# Altium schematic sheet TC PCB.SchDoc
size A4
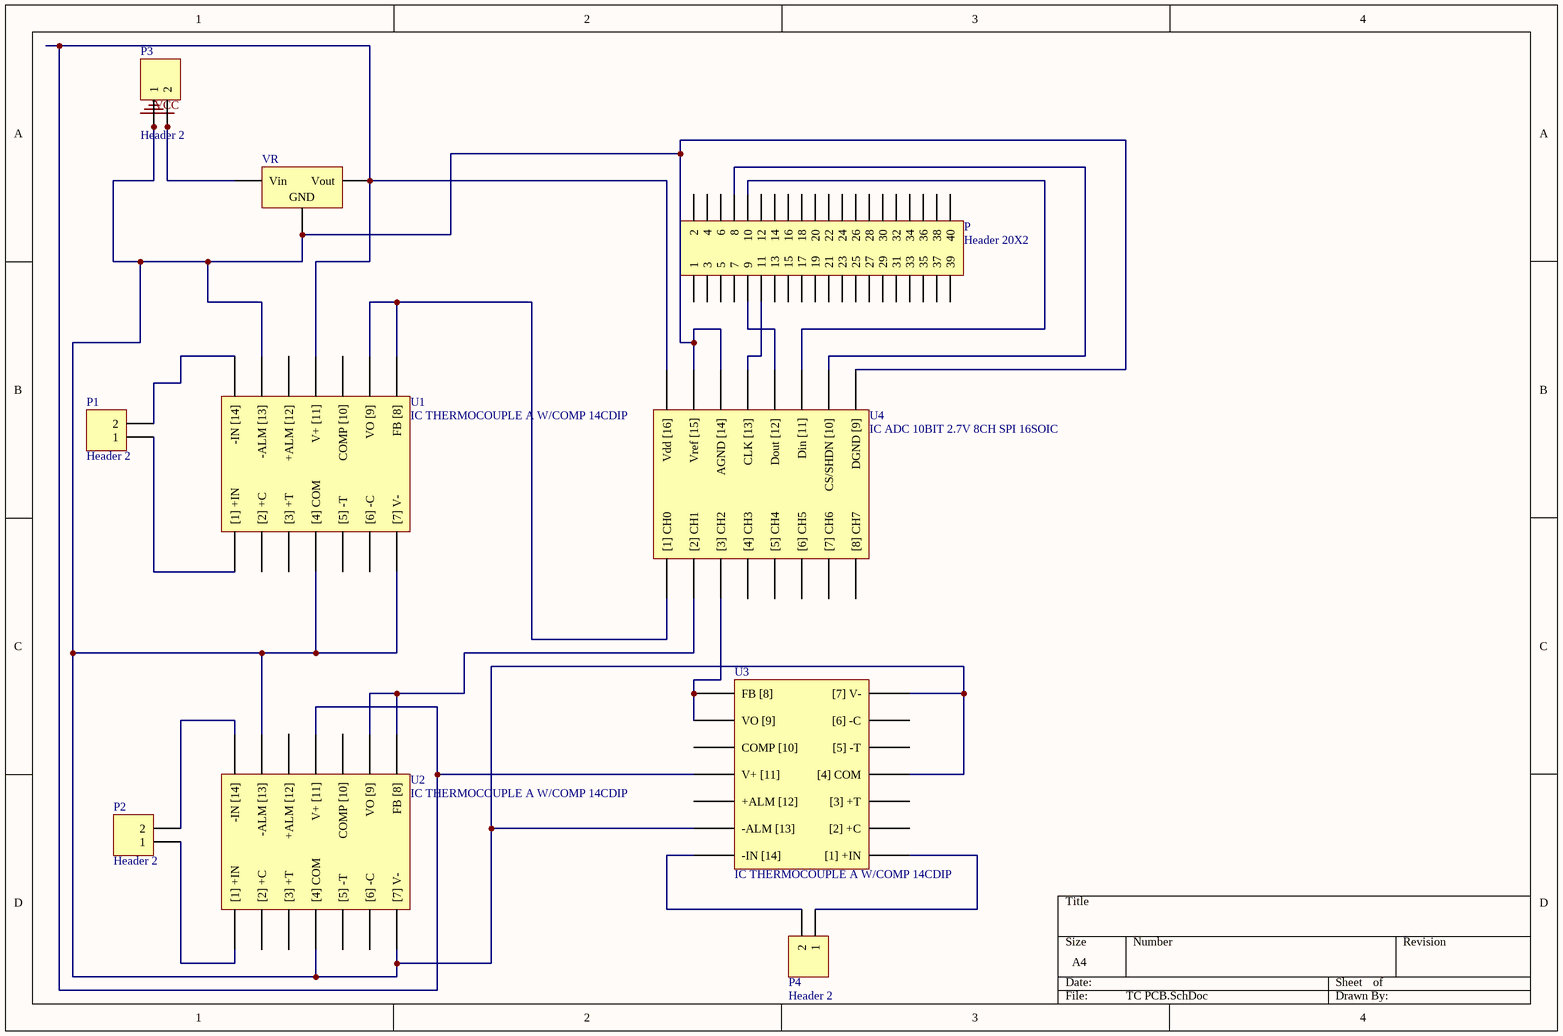
[diagram p0: TC PCB.SchDoc]

## Parts
P  Header 20X2  [HDR2X20]
P1  Header 2  [HDR1X2]
P2  Header 2  [HDR1X2]
P3  Header 2  [HDR1X2]
P4  Header 2  [HDR1X2]
U1  IC THERMOCOUPLE A W/COMP 14CDIP  [IC THERMOCOUPLE A W/COMP 14CDIP]
U2  IC THERMOCOUPLE A W/COMP 14CDIP  [IC THERMOCOUPLE A W/COMP 14CDIP]
U3  IC THERMOCOUPLE A W/COMP 14CDIP  [IC THERMOCOUPLE A W/COMP 14CDIP]
U4  IC ADC 10BIT 2.7V 8CH SPI 16SOIC  [IC ADC 10BIT 2.7V 8CH SPI 16SOIC]
VR  Volt Reg  [D2PAK_N]  (value not drawn)

## Nets
GND: P3.1 U1.4([4]_COM) U1.7([7]_V-) U1.13(-ALM_[13]) U2.4([4]_COM) U2.7([7]_V-) U2.13(-ALM_[13]) U3.4([4]_COM) U3.7([7]_V-) U3.13(-ALM_[13]) U4.9(DGND_[9]) U4.14(AGND_[14]) U4.15(Vref_[15]) VR.2(GND)
VCC: P3.2 VR.1(Vin)
NetP1_1: P1.1 U1.1([1]_+IN)
NetP1_2: P1.2 U1.14(-IN_[14])
NetP2_1: P2.1 U2.1([1]_+IN)
NetP2_2: P2.2 U2.14(-IN_[14])
NetP4_1: P4.1 U3.1([1]_+IN)
NetP4_2: P4.2 U3.14(-IN_[14])
NetP_8: P.8 U4.10(CS/SHDN_[10])
NetP_9: P.9 U4.12(Dout_[12])
NetP_10: P.10 U4.11(Din_[11])
NetP_11: P.11 U4.13(CLK_[13])
NetU1_8: U1.8(FB_[8]) U1.9(VO_[9]) U4.1([1]_CH0)
NetU1_11: U1.11(V+_[11]) U2.11(V+_[11]) U3.11(V+_[11]) U4.16(Vdd_[16]) VR.3(Vout)
NetU2_8: U2.8(FB_[8]) U2.9(VO_[9]) U4.2([2]_CH1)
NetU3_8: U3.8(FB_[8]) U3.9(VO_[9]) U4.3([3]_CH2)

Not connected (* = marked no-connect by the designer): P 1 2 3 4 5 6 7 12 13 14 15 16 17 18 19 20 21 22 23 24 25 26 27 28 29 30 31 32 33 34 35 36 37 38 39 40; U1 2([2]_+C) 3([3]_+T) 5([5]_-T) 6([6]_-C) 10(COMP_[10]) 12(+ALM_[12]); U2 2([2]_+C) 3([3]_+T) 5([5]_-T) 6([6]_-C) 10(COMP_[10]) 12(+ALM_[12]); U3 2([2]_+C) 3([3]_+T) 5([5]_-T) 6([6]_-C) 10(COMP_[10]) 12(+ALM_[12]); U4 4([4]_CH3) 5([5]_CH4) 6([6]_CH5) 7([7]_CH6) 8([8]_CH7)

## Library data of the parts
P = Header 20X2: Header, 20-Pin, Dual row; LatestRevisionDate: 17-Jul-2002; LatestRevisionNote: Re-released for DXP Platform.; Publisher: Altium Limited
P1-P4 = Header 2: Header, 2-Pin; LatestRevisionDate: 17-Jul-2002; LatestRevisionNote: Re-released for DXP Platform.; Publisher: Altium Limited
VR = Volt Reg: Voltage Regulator; Published: 24-Mar-1999; LatestRevisionDate: 29-May-2009; LatestRevisionNote: IPC-7351 Footprint Added.; PackageReference: D2PAK; Publisher: Altium Limited; PackageDescription: 3-Pin Transistor Outline Package 2.54 mm Pitch, 15.1 mm Lead Span